# EasyEDA schematic SCH_Patent-File_2025-01-08.json
TITLE: Sheet_1; REV: 1.0; Date: 2025-01-08; Sheet: 1/1; Drawn By: balajig; Company: Your Company
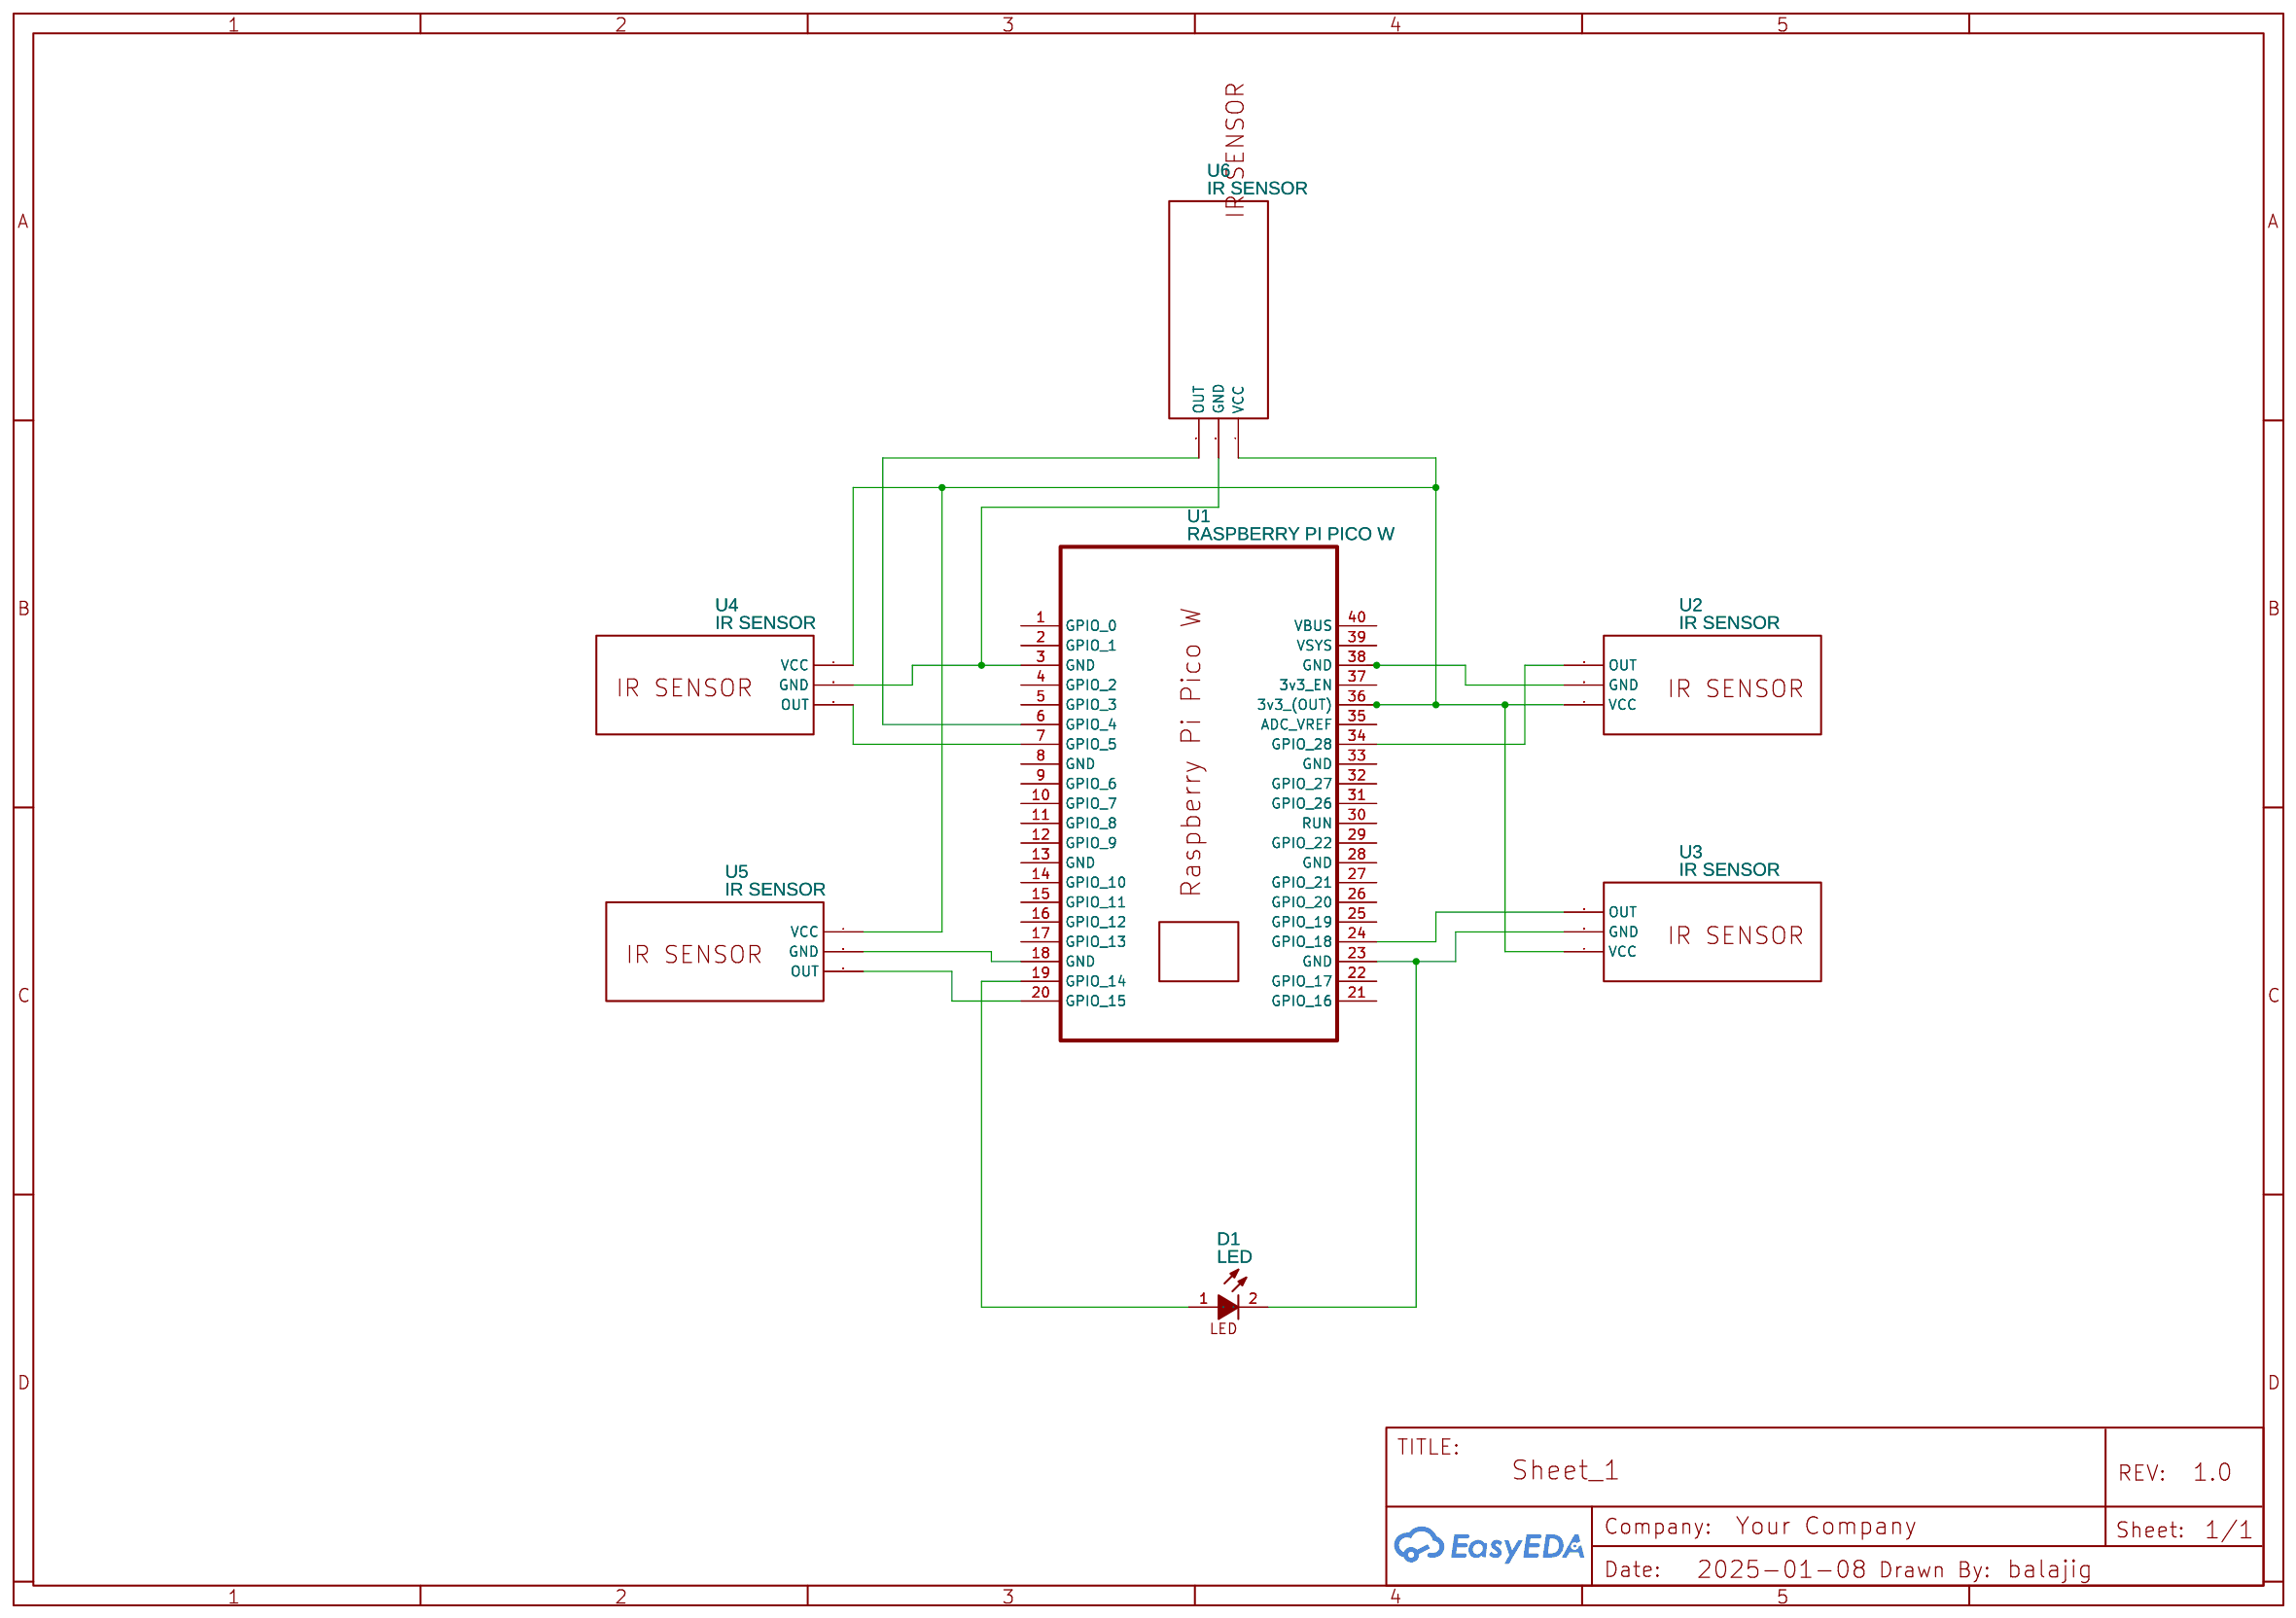
[diagram p0: schematic sheet]

## Parts
D1  LED  [LED-TH_LED-DP2-2LED-AMCC]
U1  RASPBERRY PI PICO W  [RASPBERRY PI PICO/ RASPBERRY PI PICO W]
U2  IR SENSOR  [MH-SENSOR-SERIES-LINE-SENSOR]
U3  IR SENSOR  [MH-SENSOR-SERIES-LINE-SENSOR]
U4  IR SENSOR  [MH-SENSOR-SERIES-LINE-SENSOR]
U5  IR SENSOR  [MH-SENSOR-SERIES-LINE-SENSOR]
U6  IR SENSOR  [MH-SENSOR-SERIES-LINE-SENSOR]

## Library data of the parts
D1 = LED: Supplier: Digi-Key; Manufacturer: VccLite; Manufacturer Part: 5600; Supplier Part: L20325-ND; link: https://vcclite.com/product/5602f5-5v/; Contributor: brandonmeza
U1 = RASPBERRY PI PICO W: Contributor: houston1
U2-U6 = MH-Sensor-Series Line Sensor: Contributor: prudhvi_t

## Nets
Net-(D1-1): D1.1(A) U1.19(GPIO 14)
Net-(D1-2): D1.2(K) U1.23(GND) U3.3(GND)
Net-(U1-3): U1.3(GND) U4.3(GND) U6.3(GND)
Net-(U1-6): U1.6(GPIO 4) U6.2(OUT)
Net-(U1-7): U1.7(GPIO 5) U4.2(OUT)
Net-(U1-18): U1.18(GND) U5.3(GND)
Net-(U1-20): U1.20(GPIO 15) U5.2(OUT)
Net-(U1-24): U1.24(GPIO 18) U3.2(OUT)
Net-(U1-34): U1.34(GPIO 28) U2.2(OUT)
Net-(U1-36): U1.36(3v3 (OUT)) U2.4(VCC) U3.4(VCC) U4.4(VCC) U5.4(VCC) U6.4(VCC)
Net-(U1-38): U1.38(GND) U2.3(GND)

Not connected (* = marked no-connect by the designer): U1 1(GPIO 0) 2(GPIO 1) 4(GPIO 2) 5(GPIO 3) 8(GND) 9(GPIO 6) 10(GPIO 7) 11(GPIO 8) 12(GPIO 9) 13(GND) 14(GPIO 10) 15(GPIO 11) 16(GPIO 12) 17(GPIO 13) 21(GPIO 16) 22(GPIO 17) 25(GPIO 19) 26(GPIO 20) 27(GPIO 21) 28(GND) 29(GPIO 22) 30(RUN) 31(GPIO 26) 32(GPIO 27) 33(GND) 35(ADC_VREF) 37(3v3_EN) 39(VSYS) 40(VBUS)
